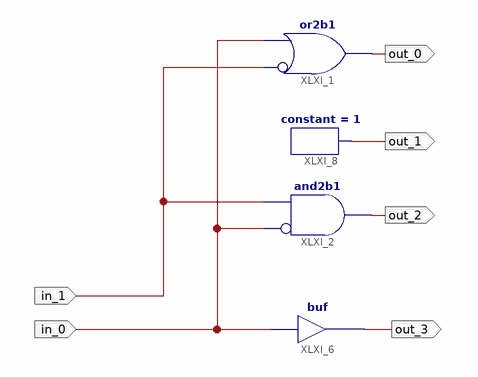
[diagram p0: schematic sheet 1]
// Xilinx ISE schematic decoder_lab1.sch (spartan3a) as structural Verilog: 4 symbols, 6 ports
module decoder_lab1 (
  input  in_1,
  input  in_0,
  output out_2,
  output out_0,
  output out_1,
  output out_3
);

  and XLXI_2 (out_2, ~in_0, in_1);  // and2b1
  or XLXI_1 (out_0, ~in_1, in_0);  // or2b1
  constant #(.CValue("1")) XLXI_8 (.O(out_1));
  buf XLXI_6 (out_3, in_0);
endmodule
